# Altium schematic sheet CTR-Lower-Main-Board-Rev-B-Power-3.SchDoc: CTR Controller - Power
size B; Author: TWL; Organization: OLogic, Inc.; DocumentNumber: 112216; Revision: A; SheetNumber: 3; SheetTotal: 4; PageSetup: Record=PageOptions|CenterHorizontal=True|CenterVertical=True|PrintScale=0.71|XCorrection=1.00|YCorrection=1.00|PrintKind=0|BorderSize=5000000|LeftOffset=0|BottomOffset=0|Orientation=2|PaperLength=1000|PaperWidth=1000|Scale=100|PaperSource=15|PrintQuality=600|MediaType=1|DitherType=10|PrintScaleMode=1|PaperKind=Letter|PaperIndex=1
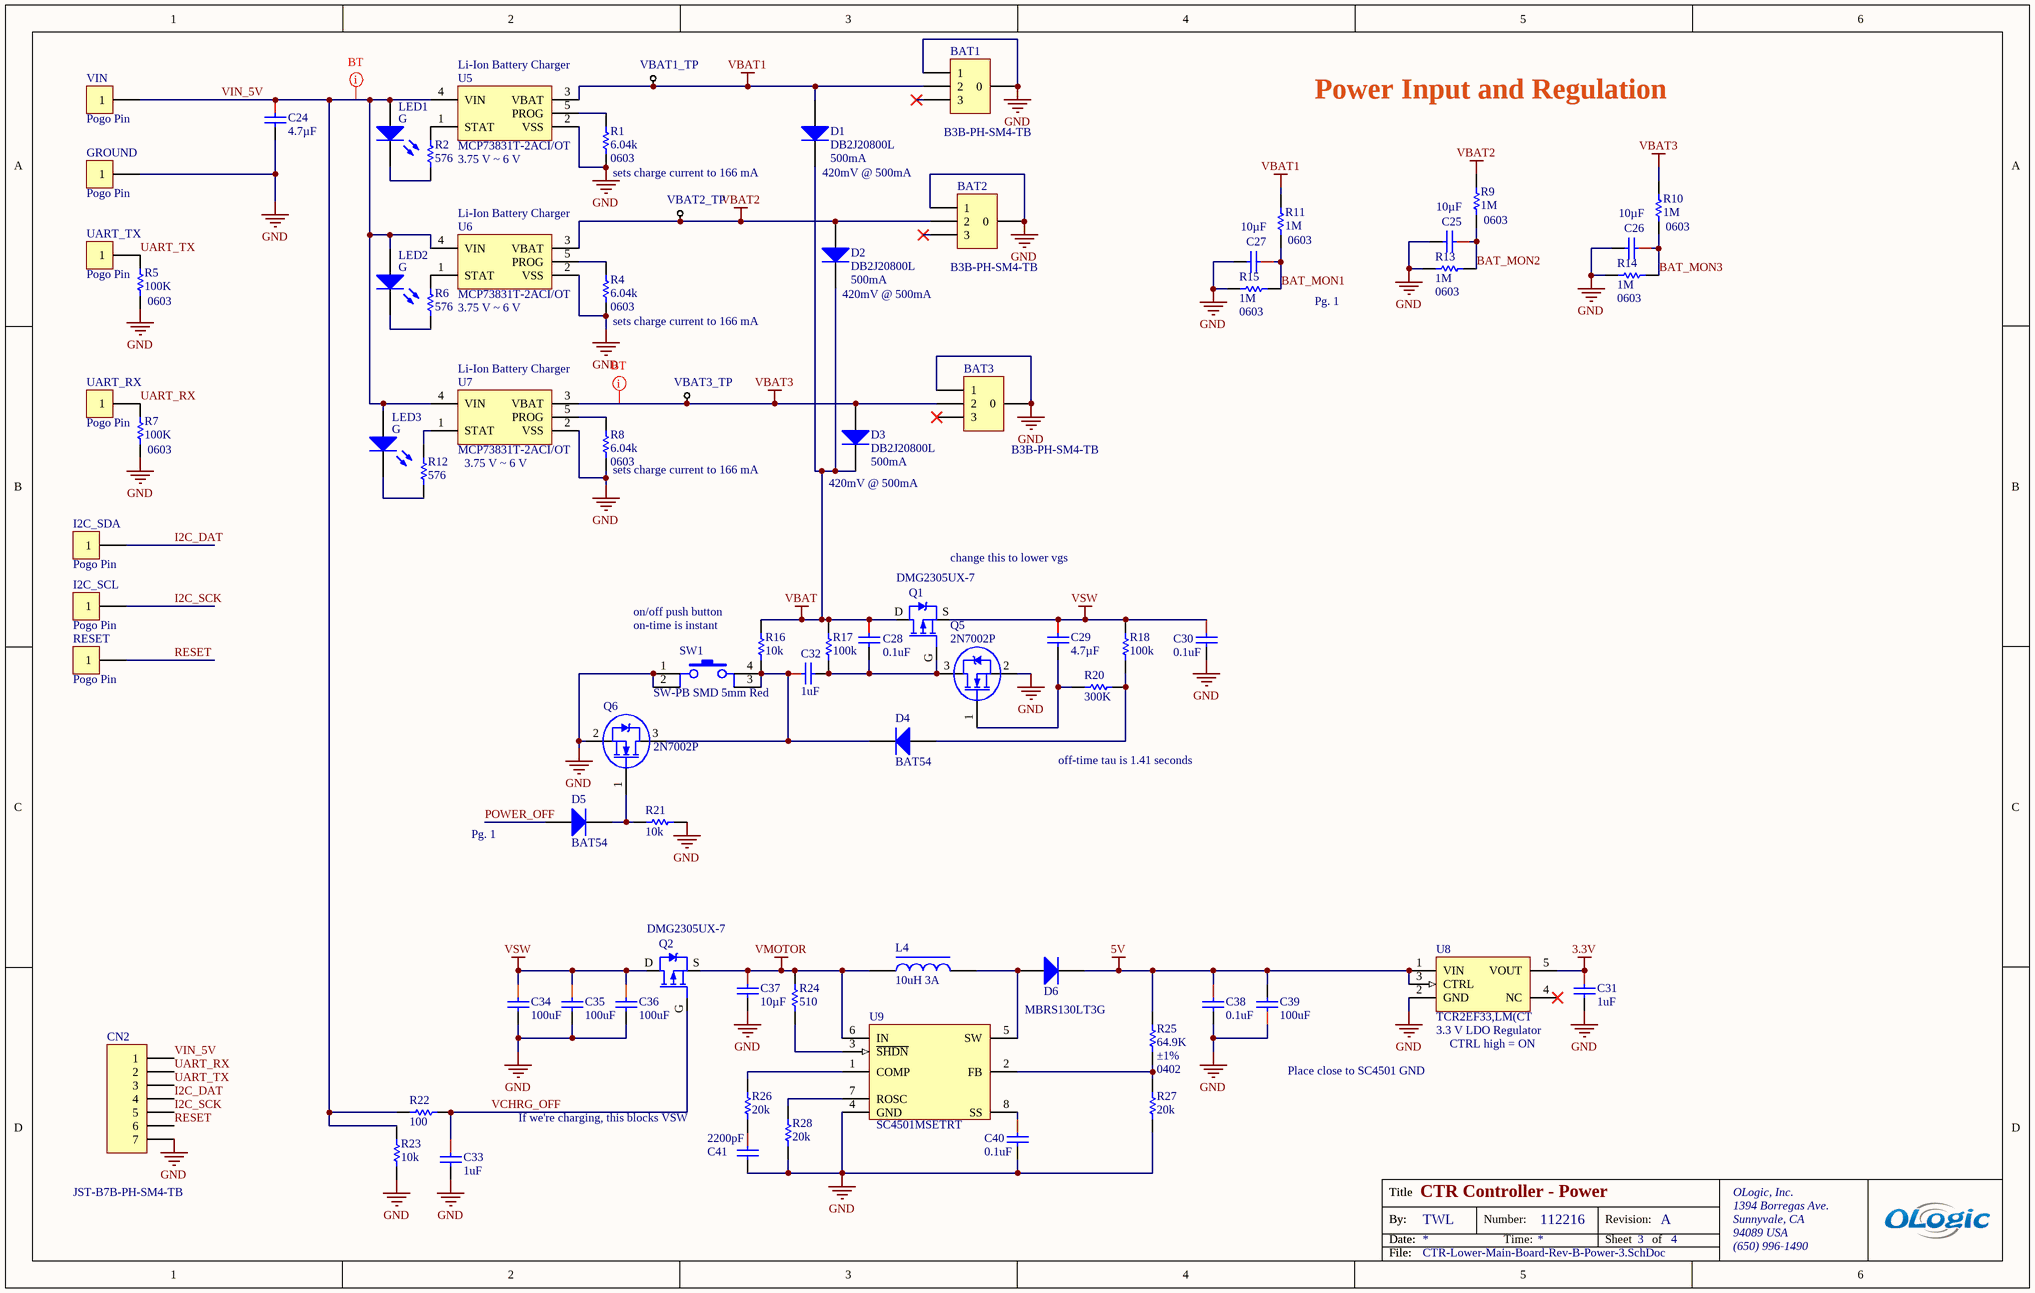
[diagram p0: CTR-Lower-Main-Board-Rev-B-Power-3.SchDoc]

## Parts
BAT1  B3B-PH-SM4-TB  [JST-B3B-PH-SM4-TB]
BAT2  B3B-PH-SM4-TB  [JST-B3B-PH-SM4-TB]
BAT3  B3B-PH-SM4-TB  [JST-B3B-PH-SM4-TB]
C24  Capacitance: 4.7µF  [CAPC0603(1608)_L]  (hidden comment: 4.7UF 0603)
C25  Capacitance: 10µF  [CAPC0603(1608)_N]  (hidden comment: CAP 10UF 10V 10% X5R 0603)
C26  Capacitance: 10µF  [CAPC0603(1608)_N]  (hidden comment: CAP 10UF 10V 10% X5R 0603)
C27  Capacitance: 10µF  [CAPC0603(1608)_N]  (hidden comment: CAP 10UF 10V 10% X5R 0603)
C28  0.1uF  [CAPC0402(1005)_N]
C29  Capacitance: 4.7µF  [CAPC0603(1608)_L]  (hidden comment: 4.7UF 0603)
C30  0.1uF  [CAPC0402(1005)_N]
C31  1uF  [CAPC0402(1005)_N]
C32  1uF  [CAPC0402(1005)_N]
C33  1uF  [CAPC0402(1005)_N]
C34  100uF  [CAPC1210(3225)_N]
C35  100uF  [CAPC1210(3225)_N]
C36  100uF  [CAPC1210(3225)_N]
C37  Capacitance: 10µF  [CAPC0603(1608)_N]  (hidden comment: CAP 10UF 10V 10% X5R 0603)
C38  0.1uF  [CAPC0402(1005)_N]
C39  100uF  [CAPC1210(3225)_N]
C40  0.1uF  [CAPC0402(1005)_N]
C41  2200pF  [CAPC0402(1005)_N]
CN2  JST-B7B-PH-SM4-TB  [JST-B7B-PH-SM4-TB]
D1  Current - Average Rectified (Io): 500mA  Voltage - Forward (Vf) (Max) @ If: 420mV @ 500mA  [SMini2-F5-B]  (hidden comment: DB2J20800L)
D2  Current - Average Rectified (Io): 500mA  Voltage - Forward (Vf) (Max) @ If: 420mV @ 500mA  [SMini2-F5-B]  (hidden comment: DB2J20800L)
D3  Current - Average Rectified (Io): 500mA  Voltage - Forward (Vf) (Max) @ If: 420mV @ 500mA  [SMini2-F5-B]  (hidden comment: DB2J20800L)
D4  BAT54  [SOT23]
D5  BAT54  [SOT23]
D6  Manufacturer Part Number: MBRS130LT3G  [DO-214AA]  (hidden comment: MBRS130LT3)
GROUND  Pogo Pin  [POGO_PIN]
I2C_SCL  Pogo Pin  [POGO_PIN]
I2C_SDA  Pogo Pin  [POGO_PIN]
L4  10uH 3A  [7x7SMINDC]
LED1  G  [SM-LED-0603]
LED2  G  [SM-LED-0603]
LED3  G  [SM-LED-0603]
Q1  DMG2305UX  [DMG2305UX-7]  (value not drawn)
Q2  DMG2305UX  [DMG2305UX-7]  (value not drawn)
Q5  2N7002P  [SOT23]
Q6  2N7002P  [SOT23]
R1  6.04k  Supplier Device Package: 0603  [RESC0603(1608)_N]
R2  576  [RESC0402(1005)_N]
R4  6.04k  Supplier Device Package: 0603  [RESC0603(1608)_N]
R5  100K  Package / Case: 0603  [RESC0603(1608)_N]
R6  576  [RESC0402(1005)_N]
R7  100K  Package / Case: 0603  [RESC0603(1608)_N]
R8  6.04k  Supplier Device Package: 0603  [RESC0603(1608)_N]
R9  1M  Supplier Device Package: 0603  [RESC0603(1608)_N]
R10  1M  Supplier Device Package: 0603  [RESC0603(1608)_N]
R11  1M  Supplier Device Package: 0603  [RESC0603(1608)_N]
R12  576  [RESC0402(1005)_N]
R13  1M  Supplier Device Package: 0603  [RESC0603(1608)_N]
R14  1M  Supplier Device Package: 0603  [RESC0603(1608)_N]
R15  1M  Supplier Device Package: 0603  [RESC0603(1608)_N]
R16  10K  [RESC0402(1005)_N]
R17  Resistance (Ohms): 100k  [RESC0402(1005)_N]  (hidden comment: 100K 0402)
R18  Resistance (Ohms): 100k  [RESC0402(1005)_N]  (hidden comment: 100K 0402)
R20  300K  [RESC0402(1005)_N]
R21  10K  [RESC0402(1005)_N]
R22  Resistance (Ohms): 100  [RESC0402(1005)_N]  (hidden comment: 100 0402)
R23  10K  [RESC0402(1005)_N]
R24  510  [RESC0603(1608)_N]
R25  64.9K  Tolerance: ±1%  Supplier Device Package: 0402  [RESC0402(1005)_N]
R26  Resistance (Ohms): 20k  [RESC0402(1005)_N]  (hidden comment: 20K 0402)
R27  Resistance (Ohms): 20k  [RESC0402(1005)_N]  (hidden comment: 20K 0402)
R28  Resistance (Ohms): 20k  [RESC0402(1005)_N]  (hidden comment: 20K 0402)
RESET  Pogo Pin  [POGO_PIN]
SW1  SW-PB SMD 5mm Red  [SW TACT Red 6mm x 6mm]
U5  Li-Ion Battery Charger  Manufacturer Part Number: MCP73831T-2ACI/OT  Voltage - Supply: 3.75 V ~ 6 V  [SOT23-5]
U6  Li-Ion Battery Charger  Manufacturer Part Number: MCP73831T-2ACI/OT  Voltage - Supply: 3.75 V ~ 6 V  [SOT23-5]
U7  Li-Ion Battery Charger  Manufacturer Part Number: MCP73831T-2ACI/OT  Voltage - Supply: 3.75 V ~ 6 V  [SOT23-5]
U8  3.3 V LDO Regulator  Manufacturer Part Number: TCR2EF33,LM(CT  [TCRFEF]
U9  Manufacturer Part Number: SC4501MSETRT  [SC4501]  (hidden comment: SC4501)
UART_RX  Pogo Pin  [POGO_PIN]
UART_TX  Pogo Pin  [POGO_PIN]
VBAT1_TP  Test Point  [TestPoint-TH 42 mil]  (value not drawn)
VBAT2_TP  Test Point  [TestPoint-TH 42 mil]  (value not drawn)
VBAT3_TP  Test Point  [TestPoint-TH 42 mil]  (value not drawn)
VIN  Pogo Pin  [POGO_PIN]

## Nets
3.3V: C31.1 U8.5(VOUT)
5V: C38.1 C39.2 D6.2(K) R25.2 U8.1(VIN) U8.3(CTRL)
GND: BAT1.0 BAT1.1 BAT2.0 BAT2.1 BAT3.0 BAT3.1 C24.2 C25.2 C26.2 C27.2 C30.2 C31.2 C33.2 C34.2 C35.2 C36.2 C37.2 C38.2 C39.1 C40.2 C41.2 CN2.0 CN2.7 GROUND.1 Q5.2(S) Q6.2(S) R1.1 R4.1 R5.1 R7.1 R8.1 R13.2 R14.2 R15.2 R21.1 R23.1 R27.1 R28.2 SW1.1 SW1.2 U5.2(VSS) U6.2(VSS) U7.2(VSS) U8.2(GND) U9.4(GND)
VBAT: C28.1 D1.1(C) D2.1(C) D3.1(C) Q1.D R16.2 R17.2
VBAT1: BAT1.2 D1.2(A) R11.2 U5.3(VBAT) VBAT1_TP.1
VBAT2: BAT2.2 D2.2(A) R9.2 U6.3(VBAT) VBAT2_TP.1
VBAT3: BAT3.2 D3.2(A) R10.2 U7.3(VBAT) VBAT3_TP.1
VMOTOR: C37.1 L4.1 Q2.S R24.2 U9.6(IN)
VSW: C29.1 C30.1 C34.1 C35.1 C36.1 Q1.S Q2.D R18.2
BAT_MON1: C27.1 R11.1 R15.1
BAT_MON2: C25.1 R9.1 R13.1
BAT_MON3: C26.1 R10.1 R14.1
I2C_DAT: CN2.4 I2C_SDA.1
I2C_SCK: CN2.5 I2C_SCL.1
POWER_OFF: D5.1(A)
RESET: CN2.6 RESET.1
UART_RX: CN2.2 R7.2 UART_RX.1
UART_TX: CN2.3 R5.2 UART_TX.1
VCHRG_OFF: C33.1 Q2.G R22.1
VIN_5V: C24.1 CN2.1 LED1.1 LED2.1 LED3.1 R22.2 R23.2 U5.4(VIN) U6.4(VIN) U7.4(VIN) VIN.1
NetC28_2: C28.2 C32.2 Q1.G Q5.3(D) R17.1
NetC29_2: C29.2 Q5.1(G) R20.2
NetC32_1: C32.1 D4.3(K) Q6.3(D) R16.1 SW1.3 SW1.4
NetC40_1: C40.1 U9.8(SS)
NetC41_1: C41.1 R26.2
NetD4_1: D4.1(A) R18.1 R20.1
NetD5_3: D5.3(K) Q6.1(G) R21.2
NetD6_1: D6.1(A) L4.2 U9.5(SW)
NetLED1_2: LED1.2 R2.2
NetLED2_2: LED2.2 R6.2
NetLED3_2: LED3.2 R12.2
NetR1_2: R1.2 U5.5(PROG)
NetR2_1: R2.1 U5.1(STAT)
NetR4_2: R4.2 U6.5(PROG)
NetR6_1: R6.1 U6.1(STAT)
NetR8_2: R8.2 U7.5(PROG)
NetR12_1: R12.1 U7.1(STAT)
NetR24_1: R24.1 U9.3(~{SHDN})
NetR25_1: R25.1 R27.2 U9.2(FB)
NetR26_1: R26.1 U9.1(COMP)
NetR28_1: R28.1 U9.7(ROSC)

Not connected (* = marked no-connect by the designer): BAT1 3*; BAT2 3*; BAT3 3*; U8 4(NC)*

## Layout directives
net class BT: VBAT3, VIN_5V

## Notes on the sheet
- Power Input and Regulation
- (near R1) sets charge current to 166 mA
- (near R4) sets charge current to 166 mA
- Pg. 1
- (near R8) sets charge current to 166 mA
- change this to lower vgs
- (near R16) on/off push button
- (near R16) on-time is instant
- off-time tau is 1.41 seconds
- CTRL high = ON
- Place close to SC4501 GND
- If we're charging, this blocks VSW
- Title
- By:
- Date:
- Number:
- Time:
- Revision:
- Sheet
- of
- OLogic, Inc.
- 1394 Borregas Ave.
- Sunnyvale, CA
- 94089 USA
- File:
- (650) 996-1490

## Library data of the parts
BAT1-BAT3 = JST-B3B-PH-SM4-TB: 2mm Locking Header, 3-Pin; Manufacturer: JST Sales America Inc; Manufacturer Part Number: B3B-PH-SM4-TB(LF)(SN)(P); Connector Type: Header, Shrouded; Number of Positions: 3; Number of Positions Loaded: All; Pitch: 0.079" (2.00mm); Supplier 1: Digi-Key; RoHS: RoHS Compliant; Category: Connectors, Interconnects; Stock 1: 32550; Pricing 1: 1=0.6, 10=0.566, 25=0.5096, 50=0.4528, 100=0.434, 250=0.39628, 500=0.37742 (USD); Packaging: Cut Tape (CT); Contact Type: Male Pin; Number of Rows: 1; Row Spacing: -; Contact Mating Length: 0.130" (3.30mm); Mounting Type: Surface Mount; Termination: Solder; Fastening Type: Detent Lock; Features: Solder Retention; Contact Finish: Tin; Contact Finish Thickness: -; Color: Natural; ComponentLink1URL: http://www.jst-mfg.com/product/pdf/eng/ePH.pdf; ComponentLink1Description: http://www.jst-mfg.com/product/pdf/eng/ePH.pdf; Supplier Part Number 1: 455-1735-1-ND; test: *
C24 C29 = CAP CER 4.7UF 16V 10% X5R 0603: Manufacturer: Taiyo Yuden; Manufacturer Part Number: EMK107ABJ475KA-T; Tolerance: ±10%; Voltage - Rated: 16V; Temperature Coefficient: X5R; ClassName: power; Supplier 1: Digi-Key; RoHS: RoHS Compliant; Category: Capacitors; Stock 1: 498907; Pricing 1: 1=0.26, 10=0.216, 50=0.1216, 100=0.108, 250=0.081, 500=0.07154, 1000=0.06345 (USD); Packaging: Cut Tape (CT); Mounting Type: Surface Mount, MLCC; Operating Temperature: -55°C ~ 85°C; Applications: General Purpose; Ratings: -; Package / Case: 0603 (1608 Metric); Size / Dimension: 0.063" L x 0.031" W (1.60mm x 0.80mm); Height - Seated (Max): -; Thickness (Max): 0.035" (0.90mm); Lead Spacing: -; Features: -; Lead Style: -; ComponentLink1URL: http://www.yuden.co.jp/or/product/category/capacitor/EMK107ABJ475KA-T.pdf; ComponentLink1Description: http://www.yuden.co.jp/or/product/category/capacitor/EMK107ABJ475KA-T.pdf; Supplier Part Number 1: 587-2786-1-ND; Creator: osman
C25-C27 C37 = CAP 10UF 10V 10% X5R 0603: 10uF 0603; Manufacturer: Samsung Electro-Mechanics America, Inc; Manufacturer Part Number: CL10A106KP8NNNC; Supplier 1: Digi-Key; RoHS: RoHS Compliant; Category: Capacitors; Stock 1: 157585; Pricing 1: 1=0.48, 10=0.42, 25=0.3, 100=0.21, 500=0.153, 1000=0.138 (USD); Packaging: Cut Tape (CT); Tolerance: ±10%; Voltage - Rated: 10V; Temperature Coefficient: X5R; Mounting Type: Surface Mount, MLCC; Operating Temperature: -55°C ~ 85°C; Applications: General Purpose; Ratings: -; Package / Case: 0603 (1608 Metric); Size / Dimension: 0.063" L x 0.031" W (1.60mm x 0.80mm); Height - Seated (Max): -; Thickness (Max): 0.035" (0.90mm); Lead Spacing: -; Features: -; Lead Style: -; ComponentLink1URL: http://www.samsungsem.com/kr/front/downloadcms.do?path=/kr/support/product-search/mlcc/__icsFiles/afieldfile/2014/11/05&fileName=S_CL10A106KP8NNNC.pdf; ComponentLink1Description: http://www.samsungsem.com/kr/front/downloadcms.do?path=/kr/support/product-search/mlcc/__icsFiles/afieldfile/2014/11/05&fileName=S_CL10A106KP8NNNC.pdf; Supplier Part Number 1: 1276-1192-1-ND; Creator: osman
  C25-C27: ClassName: *
  C37: ClassName: 5V
C28 C30 C38 C40 = CAP CER 0.1UF 50V 10% X7R 0402: 0.1uF 0402 50V; Manufacturer: TDK Corporation; Manufacturer Part Number: CGA2B3X7R1H104K050BB; Capacitance: 0.1µF; Tolerance: ±10%; Temperature Coefficient: X7R; Supplier 1: Digi-Key; RoHS: RoHS Compliant; Category: Capacitors; Stock 1: 1584397; Pricing 1: 1=0.16, 10=0.11, 100=0.0523, 250=0.044, 500=0.03686, 1000=0.03025, 5000=0.02558 (USD); Packaging: Cut Tape (CT); Voltage - Rated: 50V; Mounting Type: Surface Mount, MLCC; Operating Temperature: -55°C ~ 125°C; Applications: Automotive; Ratings: AEC-Q200; Package / Case: 0402 (1005 Metric); Size / Dimension: 0.039" L x 0.020" W (1.00mm x 0.50mm); Height - Seated (Max): -; Thickness (Max): 0.022" (0.55mm); Lead Spacing: -; Features: -; Lead Style: -; ComponentLink1URL: http://product.tdk.com/en/catalog/datasheets/mlcc_automotive_general_en.pdf; ComponentLink1Description: http://product.tdk.com/en/catalog/datasheets/mlcc_automotive_general_en.pdf; Supplier Part Number 1: 445-6899-1-ND; Creator: osman
  C28 C30: ClassName: power
  C38 C40: ClassName: 5V
C31-C33 = CAP CER 1UF 16V 10% X5R 0402: 1UF 0402; Manufacturer: TDK Corporation; Manufacturer Part Number: C1005X5R1C105K050BC; Capacitance: 1.0µF; Tolerance: ±10%; Voltage - Rated: 16V; Temperature Coefficient: X5R; ClassName: power; Supplier 1: Digi-Key; RoHS: RoHS Compliant; Category: Capacitors; Stock 1: 490204; Pricing 1: 1=0.12, 10=0.08, 100=0.038, 250=0.032, 500=0.0268, 1000=0.022, 5000=0.0186 (USD); Packaging: Cut Tape (CT); Mounting Type: Surface Mount, MLCC; Operating Temperature: -55°C ~ 85°C; Applications: General Purpose; Ratings: -; Package / Case: 0402 (1005 Metric); Size / Dimension: 0.039" L x 0.020" W (1.00mm x 0.50mm); Height - Seated (Max): -; Thickness (Max): 0.022" (0.55mm); Lead Spacing: -; Features: -; Lead Style: -; ComponentLink1URL: http://product.tdk.com/en/catalog/datasheets/mlcc_commercial_general_en.pdf; ComponentLink1Description: http://product.tdk.com/en/catalog/datasheets/mlcc_commercial_general_en.pdf; Supplier Part Number 1: 445-4978-1-ND
C34-C36 C39 = CAP CER 100UF 16V 20% X5R 1210: 100uF 1210; Manufacturer: Taiyo Yuden; Manufacturer Part Number: EMK325ABJ107MM-T; Capacitance: 100µF; Tolerance: ±20%; Voltage - Rated: 16V; Temperature Coefficient: X5R; ClassName: 5V; Supplier 1: Digi-Key; RoHS: RoHS Compliant; Category: Capacitors; Stock 1: 220900; Pricing 1: 1=2.3, 10=1.882, 50=1.6524, 100=1.3311, 250=1.1016 (USD); Packaging: Cut Tape (CT); Mounting Type: Surface Mount, MLCC; Operating Temperature: -55°C ~ 85°C; Applications: General Purpose; Ratings: -; Package / Case: 1210 (3225 Metric); Size / Dimension: 0.126" L x 0.098" W (3.20mm x 2.50mm); Height - Seated (Max): -; Thickness (Max): 0.106" (2.70mm); Lead Spacing: -; Features: -; Lead Style: -; ComponentLink1URL: http://www.yuden.co.jp/productdata/catalog/en/mlcc_all_e.pdf; ComponentLink1Description: http://www.yuden.co.jp/productdata/catalog/en/mlcc_all_e.pdf; Supplier Part Number 1: 587-3152-1-ND
C41 = CAP CER 2200PF 50V 10% X7R 0402: 2200pF 0402; Manufacturer: Yageo; Manufacturer Part Number: CC0402KRX7R9BB222; Tolerance: ±10%; Voltage - Rated: 50V; Temperature Coefficient: X7R; Supplier 1: Digi-Key; RoHS: RoHS Compliant; Category: Capacitors; Stock 1: 591174; Pricing 1: 1=0.1, 10=0.014, 25=0.0096, 100=0.0062, 250=0.00508, 500=0.00436, 1000=0.00339, 2500=0.00305, 5000=0.00283 (USD); Packaging: Cut Tape (CT); Capacitance: 2200pF; Mounting Type: Surface Mount, MLCC; Operating Temperature: -55°C ~ 125°C; Applications: General Purpose; Ratings: -; Package / Case: 0402 (1005 Metric); Size / Dimension: 0.039" L x 0.020" W (1.00mm x 0.50mm); Height - Seated (Max): -; Thickness (Max): 0.022" (0.55mm); Lead Spacing: -; Features: -; Lead Style: -; ComponentLink1URL: http://www.yageo.com/documents/recent/UPY-GPHC_X7R_6.3V-to-50V-v12.pdf; ComponentLink1Description: http://www.yageo.com/documents/recent/UPY-GPHC_X7R_6.3V-to-50V-v12.pdf; Supplier Part Number 1: 311-1037-1-ND; Creator: osman; ClassName: 5V
CN2 = JST-B7B-PH-SM4-TB: 2mm Locking Header, 7-Pin; Manufacturer: JST Sales America Inc.; Manufacturer Part Number: B7B-PH-SM4-TB(LF)(SN); Connector Type: Header, Shrouded; Number of Positions: 7; Number of Positions Loaded: All; Pitch: 0.079" (2.00mm); Supplier 1: Digi-Key; RoHS: RoHS Compliant; Category: Connectors, Interconnects; Stock 1: 5844; Pricing 1: 1=0.94, 10=0.827, 100=0.7138, 500=0.58404 (USD); Packaging: Cut Tape (CT); Contact Type: Male Pin; Number of Rows: 1; Row Spacing: -; Contact Mating Length: 0.130" (3.30mm); Mounting Type: Surface Mount; Termination: Solder; Fastening Type: Detent Lock; Features: Solder Retention; Contact Finish: Tin; Contact Finish Thickness: -; Color: Natural; ComponentLink1URL: http://www.jst-mfg.com/product/pdf/eng/ePH.pdf; ComponentLink1Description: http://www.jst-mfg.com/product/pdf/eng/ePH.pdf; Supplier Part Number 1: 455-1739-1-ND
D1-D3 = DB2J20800L: DIODE SCHOTTKY 20V 500MA SMINI2; Manufacturer: Panasonic Electronic Components; Speed: Fast Recovery =< 500ns, > 200mA (Io); Reverse Recovery Time (trr): 4.3ns; Current - Reverse Leakage @ Vr: 200µA @ 20V; Capacitance @ Vr, F: 12pF @ 10V, 1MHz; Supplier 1: Digi-Key; RoHS: RoHS Compliant; Category: Discrete Semiconductor Products; Stock 1: 1539; Pricing 1: 1=0.1, 10=0.08, 25=0.0644, 100=0.0501, 250=0.04864, 500=0.0472, 1000=0.0429 (USD); Packaging: Cut Tape (CT); Diode Type: Schottky; Voltage - DC Reverse (Vr) (Max): 20V; Mounting Type: Surface Mount; Package / Case: SC-90, SOD-323F; Supplier Device Package: SMini2-F5-B; Operating Temperature - Junction: 125°C (Max); ComponentLink1URL: http://industrial.panasonic.com/www-cgi/jvcr13pz.cgi?E+SC+4+CDF7002+DB2J208+8+WW; ComponentLink1Description: http://industrial.panasonic.com/www-cgi/jvcr13pz.cgi?E+SC+4+CDF7002+DB2J208+8+WW; Supplier Part Number 1: DB2J20800LCT-ND; Creator: osman; Manufacturer Part Number: DB2J20800L
D4 D5 = BAT54: Schottky Barrier Diode; Manufacturer: Fairchild; Vendor: Digikey; PN: BAT54FSCT-ND; Voltage - DC Reverse (Vr) (Max): 30V; Current - Average Rectified (Io): 200mA; Voltage - Forward (Vf) (Max) @ If: 800mV @ 100mA; Speed: Small Signal =< 200mA (Io), Any Speed; Reverse Recovery Time (trr): 5ns; Current - Reverse Leakage @ Vr: 2µA @ 25V; Capacitance @ Vr, F: 10pF @ 1V, 1MHz; Supplier 1: Digi-Key; Manufacturer Part Number: BAT54; RoHS: RoHS Compliant; Category: Discrete Semiconductor Products; Stock 1: 104473; Pricing 1: 1=0.15, 10=0.142, 25=0.1288, 100=0.0927, 250=0.0546, 500=0.0453, 1000=0.0309 (USD); Packaging: Cut Tape (CT); Diode Type: Schottky; Mounting Type: Surface Mount; Package / Case: TO-236-3, SC-59, SOT-23-3; Supplier Device Package: SOT-23-3 (TO-236); Operating Temperature - Junction: -55°C ~ 150°C; ComponentLink1URL: http://www.fairchildsemi.com/datasheets/BA/BAT54.pdf; ComponentLink1Description: http://www.fairchildsemi.com/datasheets/BA/BAT54.pdf; Supplier Part Number 1: BAT54FSCT-ND; ClassName: power
D6 = MBRS130LT3: Schottky Barrier Rectifier 1A 30V; Manufacturer: ON Semiconductor; Current - Average Rectified (Io): 2A; Voltage - Forward (Vf) (Max) @ If: 445mV @ 2A; Speed: Fast Recovery =< 500ns, > 200mA (Io); Current - Reverse Leakage @ Vr: 1mA @ 30V; Supplier 1: Digi-Key; Supplier Part Number 1: MBRS130LT3GOSCT-ND; RoHS: RoHS Compliant; Category: Discrete Semiconductor Products; Stock 1: 53201; Pricing 1: 1=0.42, 10=0.317, 100=0.1977, 500=0.13526, 1000=0.10404 (USD); Packaging: Cut Tape (CT); Part Status: Active; Diode Type: Schottky; Voltage - DC Reverse (Vr) (Max): 30V; Reverse Recovery Time (trr): -; Capacitance @ Vr, F: -; Mounting Type: Surface Mount; Package / Case: DO-214AA, SMB; Supplier Device Package: SMB; Operating Temperature - Junction: -65°C ~ 125°C; ComponentLink1URL: http://www.onsemi.com/pub_link/Collateral/MBRS130LT3-D.PDF; ComponentLink1Description: http://www.onsemi.com/pub_link/Collateral/MBRS130LT3-D.PDF
GROUND I2C_SCL I2C_SDA RESET UART_RX UART_TX VIN = 0850-0-15-20-83-14-11-0: Manufacturer: Mill-Max Manufacturing Corp.; Plating: Gold; Plating - Thickness: 20µin (0.51µm); Supplier 1: Digi-Key; Manufacturer Part Number: 0850-0-15-20-83-14-11-0; RoHS: RoHS Compliant; Category: Connectors, Interconnects; Stock 1: 38651; Pricing 1: 1=1.89, 10=1.47, 25=1.3708, 50=1.246, 100=1.1214, 250=0.94696, 500=0.89712, 1000=0.79744, 2500=0.66287 (USD); Part Status: Active; Material: Copper Alloy; Mounting Type: Through Hole; ComponentLink1URL: http://www.mill-max.com/assets/pdfs/028.pdf; ComponentLink1Description: http://www.mill-max.com/assets/pdfs/028.pdf; Supplier Part Number 1: ED90436-ND
L4 = INDUCTOR PWR 10UH 3A SMD: 10uH 3A 7.8x7.0mm; Manufacturer: Bourns Inc.; Manufacturer Part Number: SRP7030-100M; Type: Wirewound; Material - Core: Iron; Inductance: 10µH; Tolerance: ±20%; Current - Saturation: 4.5A; Shielding: Shielded; DC Resistance (DCR): 85 mOhm Max; Frequency - Test: 100kHz; Supplier 1: Digi-Key; RoHS: RoHS Compliant; Category: Inductors, Coils, Chokes; Stock 1: 3936; Pricing 1: 1=1.11, 10=1.041, 25=0.9712, 50=0.8326, 100=0.7909, 250=0.72152, 500=0.63826 (USD); Packaging: Cut Tape (CT); Current Rating: 3A; Q @ Freq: -; Frequency - Self Resonant: -; Operating Temperature: -55°C ~ 150°C; Mounting Type: Surface Mount; Package / Case: Non Standard; Size / Dimension: 0.307" L x 0.276" W (7.80mm x 7.00mm); Height - Seated (Max): 0.126" (3.20mm); Supplier Device Package: -; ComponentLink1URL: http://www.bourns.com/data/global/pdfs/SRP7030.pdf; ComponentLink1Description: http://www.bourns.com/data/global/pdfs/SRP7030.pdf; Supplier Part Number 1: SRP7030-100MCT-ND; ClassName: 5V
LED1-LED3 = LED GREEN CLEAR THIN 0603 SMD: 0603 SMD GREEN LED; Manufacturer: Lite-On Inc; Manufacturer Part Number: LTST-C191KGKT; Wavelength - Dominant: 571nm; Wavelength - Peak: 574nm; Millicandela Rating: 35mcd; Voltage - Forward (Vf) (Typ): 2V; Current - Test: 20mA; Viewing Angle: 130°; Lens Type: Clear; Lens Style/Size: Rectangle with Flat Top, 1.1mm x 0.8mm; Supplier 1: Digi-Key; RoHS: RoHS Compliant; Category: Optoelectronics; Stock 1: 84829; Pricing 1: 1=0.3, 10=0.238, 100=0.1296, 250=0.0864, 500=0.07344, 1000=0.05616, 2500=0.05076 (USD); Packaging: Cut Tape (CT); Color: Green; Package / Case: 0603 (1608 Metric); Size / Dimension: 1.60mm L x 0.80mm W; Height: 0.55mm; Mounting Type: Surface Mount; Luminous Flux @ Current - Test: -; ComponentLink1URL: http://optoelectronics.liteon.com/upload/download/DS22-2000-228/S_110_LTST-C191KGKT.pdf; ComponentLink1Description: http://optoelectronics.liteon.com/upload/download/DS22-2000-228/S_110_LTST-C191KGKT.pdf; Supplier Part Number 1: 160-1446-1-ND; ClassName: power
Q1 Q2 = DMG2305UX: MOSFET P-CH 20V 4.2A SOT23; Manufacturer: Diodes Incorporated; FET Type: MOSFET P-Channel, Metal Oxide; FET Feature: Standard; Current - Continuous Drain (Id) @ 25°C: 4.2A (Ta); Rds On (Max) @ Id, Vgs: 52 mOhm @ 4.2A, 4.5V; Vgs(th) (Max) @ Id: 900mV @ 250µA; Gate Charge (Qg) @ Vgs: 10.2nC @ 4.5V; Input Capacitance (Ciss) @ Vds: 808pF @ 15V; Power - Max: 1.4W; Supplier 1: Digi-Key; RoHS: RoHS Compliant; Category: Discrete Semiconductor Products; Stock 1: 78669; Pricing 1: 1=0.38, 10=0.311, 100=0.1649, 500=0.10846, 1000=0.0739 (USD); Packaging: Cut Tape (CT); Drain to Source Voltage (Vdss): 20V; Operating Temperature: -55°C ~ 150°C (TJ); Mounting Type: Surface Mount; Package / Case: TO-236-3, SC-59, SOT-23-3; Supplier Device Package: SOT-23; ComponentLink1URL: http://www.diodes.com/_files/datasheets/DMG2305UX.pdf; ComponentLink1Description: http://www.diodes.com/_files/datasheets/DMG2305UX.pdf; Supplier Part Number 1: DMG2305UX-7DICT-ND; Creator: osman; Manufacturer Part Number: DMG2305UX-7
Q5 Q6 = 2N7002P: MOSFET N-CH 60V 0.36A SOT-23; Manufacturer: NXP Semiconductors; Manufacturer Part Number: 2N7002P,235; FET Type: MOSFET N-Channel, Metal Oxide; FET Feature: Logic Level Gate; Current - Continuous Drain (Id) @ 25°C: 360mA (Ta); Rds On (Max) @ Id, Vgs: 1.6 Ohm @ 500mA, 10V; Vgs(th) (Max) @ Id: 2.4V @ 250µA; Gate Charge (Qg) @ Vgs: 0.8nC @ 4.5V; Input Capacitance (Ciss) @ Vds: 50pF @ 10V; Power - Max: 350mW; Supplier 1: Digi-Key; RoHS: RoHS Compliant; Category: Discrete Semiconductor Products; Stock 1: 4190; Pricing 1: 1=0.15, 10=0.135, 25=0.1224, 100=0.0881, 250=0.05188, 500=0.04304, 1000=0.02936, 2500=0.02498, 5000=0.02252 (USD); Packaging: Cut Tape (CT); Drain to Source Voltage (Vdss): 60V; Mounting Type: Surface Mount; Package / Case: TO-236-3, SC-59, SOT-23-3; Supplier Device Package: SOT-23 (TO-236AB); ComponentLink1URL: http://www.nxp.com/documents/data_sheet/2N7002P.pdf; ComponentLink1Description: http://www.nxp.com/documents/data_sheet/2N7002P.pdf; Supplier Part Number 1: 568-11588-1-ND; ClassName: power
R1 R4 R8 = RES 6.04K OHM 1/8W 1% 0603: 6.04K 0603 RNCP0603FTD6K04; Manufacturer: Stackpole Electronics Inc.; Tolerance: ±1%; Power (Watts): 0.125W, 1/8W; Temperature Coefficient: ±100ppm/°C; Supplier 1: Digi-Key; Manufacturer Part Number: RNCP0603FTD6K04; RoHS: RoHS Compliant; Category: Resistors; Stock 1: 13656; Pricing 1: 1=0.1, 10=0.029, 25=0.0208, 50=0.0158, 100=0.0117, 250=0.00892, 500=0.00712, 1000=0.00525 (USD); Packaging: Cut Tape (CT); Part Status: Active; Resistance (Ohms): 6.04k; Composition: Thin Film; Features: Anti-Sulfur, Moisture Resistant; Operating Temperature: -55°C ~ 155°C; Package / Case: 0603 (1608 Metric); Size / Dimension: 0.059" L x 0.031" W (1.50mm x 0.80mm); Height - Seated (Max): 0.020" (0.50mm); Number of Terminations: 2; Failure Rate: -; ComponentLink1URL: http://www.seielect.com/Catalog/SEI-rncp.pdf; ComponentLink1Description: http://www.seielect.com/Catalog/SEI-rncp.pdf; Supplier Part Number 1: RNCP0603FTD6K04CT-ND
R2 R6 R12 = RES 576 OHM 1% 1/10W 0402: 575 0402; Manufacturer: Panasonic Electronic Components; Manufacturer Part Number: ERJ-2RKF5760X; Tolerance: ±1%; Power (Watts): 0.1W, 1/10W; Temperature Coefficient: ±100ppm/°C; ClassName: power; Supplier 1: Digi-Key; RoHS: RoHS Compliant; Category: Resistors; Stock 1: 89189; Pricing 1: 1=0.1, 50=0.0196, 100=0.0149, 250=0.01104, 500=0.00816, 1000=0.00544, 5000=0.00383 (USD); Packaging: Cut Tape (CT); Composition: Thick Film; Features: Automotive AEC-Q200; Operating Temperature: -55°C ~ 155°C; Package / Case: 0402 (1005 Metric); Supplier Device Package: 0402; Size / Dimension: 0.039" L x 0.020" W (1.00mm x 0.50mm); Height: 0.016" (0.40mm); Number of Terminations: 2; ComponentLink1URL: http://industrial.panasonic.com/www-cgi/jvcr13pz.cgi?E+PZ+3+AOA0002+ERJ2RKF5760X+7+WW; ComponentLink1Description: http://industrial.panasonic.com/www-cgi/jvcr13pz.cgi?E+PZ+3+AOA0002+ERJ2RKF5760X+7+WW; Supplier Part Number 1: P576LCT-ND; Creator: osman; Resistance (Ohms): 576
R5 R7 = RES 100K OHM 5% 1/4W 0603: 100K 0603; Manufacturer: Rohm Semiconductor; Manufacturer Part Number: ESR03EZPJ104; Tolerance: ±5%; Power (Watts): 0.25W, 1/4W; Temperature Coefficient: ±200ppm/°C; Supplier 1: Digi-Key; RoHS: RoHS Compliant; Category: Resistors; Stock 1: 33839; Pricing 1: 1=0.1, 10=0.079, 25=0.0544, 100=0.0303, 250=0.0236, 500=0.01876, 1000=0.01331 (USD); Packaging: Cut Tape (CT); Resistance (Ohms): 100k; Composition: Thick Film; Features: Automotive AEC-Q200, Pulse Withstanding; Operating Temperature: -55°C ~ 155°C; Supplier Device Package: 0603 (1608 Metric); Size / Dimension: 0.063" L x 0.031" W (1.60mm x 0.80mm); Height: 0.022" (0.55mm); Number of Terminations: 2; ComponentLink1URL: http://rohmfs.rohm.com/en/products/databook/datasheet/passive/resistor/chip_resistor/esr.pdf; ComponentLink1Description: http://rohmfs.rohm.com/en/products/databook/datasheet/passive/resistor/chip_resistor/esr.pdf; Supplier Part Number 1: RHM100KDCT-ND
R9-R11 R13-R15 = RES 1M OHM 1/10W 1% 0603 SMD: 1M 0603; Manufacturer: Panasonic Electronic Components; Manufacturer Part Number: ERJ-3EKF1004V; Tolerance: ±1%; Power (Watts): 0.1W, 1/10W; Temperature Coefficient: ±100ppm/°C; Supplier 1: Digi-Key; RoHS: RoHS Compliant; Category: Resistors; Stock 1: 709119; Pricing 1: 1=0.1, 50=0.015, 100=0.0114, 250=0.00844, 500=0.00624, 1000=0.00416, 2500=0.00351 (USD); Packaging: Cut Tape (CT); Resistance (Ohms): 1M; Composition: Thick Film; Features: -; Package / Case: 0603 (1608 Metric); Size / Dimension: 0.063" L x 0.031" W (1.60mm x 0.80mm); Height: 0.022" (0.55mm); Number of Terminations: 2; ComponentLink1URL: http://industrial.panasonic.com/www-cgi/jvcr13pz.cgi?E+PZ+3+AOA0002+ERJ3EKF1004V+7+WW; ComponentLink1Description: http://industrial.panasonic.com/www-cgi/jvcr13pz.cgi?E+PZ+3+AOA0002+ERJ3EKF1004V+7+WW; Supplier Part Number 1: P1.00MHCT-ND
R16 R21 R23 = RES 10K OHM 1% 1/10W 0402: 10K 0402; Manufacturer: Panasonic Electronic Components; Manufacturer Part Number: ERJ-2RKF1002X; Tolerance: ±1%; Power (Watts): 0.1W, 1/10W; Temperature Coefficient: ±100ppm/°C; ClassName: power; Supplier 1: Digi-Key; RoHS: RoHS Compliant; Category: Resistors; Stock 1: 8784573; Pricing 1: 1=0.1, 50=0.0196, 100=0.0149, 250=0.01104, 500=0.00816, 1000=0.00544, 5000=0.00383 (USD); Packaging: Cut Tape (CT); Composition: Thick Film; Features: Automotive AEC-Q200; Operating Temperature: -55°C ~ 155°C; Package / Case: 0402 (1005 Metric); Supplier Device Package: 0402; Size / Dimension: 0.039" L x 0.020" W (1.00mm x 0.50mm); Height: 0.016" (0.40mm); Number of Terminations: 2; ComponentLink1URL: http://industrial.panasonic.com/www-cgi/jvcr13pz.cgi?E+PZ+3+AOA0002+ERJ2RKF1002X+7+WW; ComponentLink1Description: http://industrial.panasonic.com/www-cgi/jvcr13pz.cgi?E+PZ+3+AOA0002+ERJ2RKF1002X+7+WW; Supplier Part Number 1: P10.0KLCT-ND; Creator: osman; Resistance (Ohms): 10k
R17 R18 = RES 100K OHM 1% 1/10W 0402: Manufacturer: Panasonic Electronic Components; Manufacturer Part Number: ERJ-2RKF1003X; Tolerance: ±1%; Power (Watts): 0.1W, 1/10W; Temperature Coefficient: ±100ppm/°C; ClassName: power; Supplier 1: Digi-Key; RoHS: RoHS Compliant; Category: Resistors; Stock 1: 3706939; Pricing 1: 1=0.1, 50=0.0196, 100=0.0149, 250=0.01104, 500=0.00816, 1000=0.00544, 5000=0.00383 (USD); Packaging: Cut Tape (CT); Composition: Thick Film; Features: Automotive AEC-Q200; Operating Temperature: -55°C ~ 155°C; Package / Case: 0402 (1005 Metric); Supplier Device Package: 0402; Size / Dimension: 0.039" L x 0.020" W (1.00mm x 0.50mm); Height: 0.016" (0.40mm); Number of Terminations: 2; ComponentLink1URL: http://industrial.panasonic.com/www-cgi/jvcr13pz.cgi?E+PZ+3+AOA0002+ERJ2RKF1003X+7+WW; ComponentLink1Description: http://industrial.panasonic.com/www-cgi/jvcr13pz.cgi?E+PZ+3+AOA0002+ERJ2RKF1003X+7+WW; Supplier Part Number 1: P100KLCT-ND; Creator: osman
R20 = RES 300K OHM 1% 1/10W 0402: 300K 0402; Manufacturer: Panasonic Electronic Components; Manufacturer Part Number: ERJ-2RKF3003X; Tolerance: ±1%; Power (Watts): 0.1W, 1/10W; Temperature Coefficient: ±100ppm/°C; ClassName: power; Supplier 1: Digi-Key; RoHS: RoHS Compliant; Category: Resistors; Stock 1: 135201; Pricing 1: 1=0.1, 50=0.015, 100=0.011, 250=0.0084, 500=0.00674, 1000=0.00496, 5000=0.00355 (USD); Packaging: Cut Tape (CT); Resistance (Ohms): 300k; Composition: Thick Film; Features: Automotive AEC-Q200; Operating Temperature: -55°C ~ 155°C; Package / Case: 0402 (1005 Metric); Supplier Device Package: 0402; Size / Dimension: 0.039" L x 0.020" W (1.00mm x 0.50mm); Height: 0.016" (0.40mm); Number of Terminations: 2; ComponentLink1URL: http://industrial.panasonic.com/www-cgi/jvcr13pz.cgi?E+PZ+3+AOA0002+ERJ2RKF3003X+7+WW; ComponentLink1Description: http://industrial.panasonic.com/www-cgi/jvcr13pz.cgi?E+PZ+3+AOA0002+ERJ2RKF3003X+7+WW; Supplier Part Number 1: P300KLCT-ND
R22 = RES 100 OHM 1% 1/10W 0402: Manufacturer: Panasonic Electronic Components; Manufacturer Part Number: ERJ-2RKF1000X; Tolerance: ±1%; Power (Watts): 0.1W, 1/10W; Temperature Coefficient: ±100ppm/°C; ClassName: power; Creator: osman; Supplier 1: Digi-Key; RoHS: RoHS Compliant; Category: Resistors; Stock 1: 3222499; Pricing 1: 1=0.1, 50=0.0196, 100=0.0149, 250=0.01104, 500=0.00816, 1000=0.00544, 5000=0.00383 (USD); Packaging: Cut Tape (CT); Composition: Thick Film; Features: Automotive AEC-Q200; Operating Temperature: -55°C ~ 155°C; Package / Case: 0402 (1005 Metric); Supplier Device Package: 0402; Size / Dimension: 0.039" L x 0.020" W (1.00mm x 0.50mm); Height: 0.016" (0.40mm); Number of Terminations: 2; ComponentLink1URL: http://industrial.panasonic.com/www-cgi/jvcr13pz.cgi?E+PZ+3+AOA0002+ERJ2RKF1000X+7+WW; ComponentLink1Description: http://industrial.panasonic.com/www-cgi/jvcr13pz.cgi?E+PZ+3+AOA0002+ERJ2RKF1000X+7+WW; Supplier Part Number 1: P100LCT-ND
R24 = RES 510 OHM 1/10W 1% 0603 SMD: 510 0603; Manufacturer: Panasonic Electronic Components; Manufacturer Part Number: ERJ-3EKF5100V; Tolerance: ±1%; Power (Watts): 0.1W, 1/10W; Temperature Coefficient: ±100ppm/°C; Supplier 1: Digi-Key; RoHS: RoHS Compliant; Category: power; Stock 1: 60158; Pricing 1: 1=0.1, 50=0.015, 100=0.0114, 250=0.00844, 500=0.00624, 1000=0.00416, 2500=0.00351 (USD); Packaging: Cut Tape (CT); Resistance (Ohms): 510; Composition: Thick Film; Features: -; Package / Case: 0603 (1608 Metric); Supplier Device Package: 0603; Size / Dimension: 0.063" L x 0.031" W (1.60mm x 0.80mm); Height: 0.022" (0.55mm); Number of Terminations: 2; ComponentLink1URL: http://industrial.panasonic.com/www-cgi/jvcr13pz.cgi?E+PZ+3+AOA0002+ERJ3EKF5100V+7+WW; ComponentLink1Description: http://industrial.panasonic.com/www-cgi/jvcr13pz.cgi?E+PZ+3+AOA0002+ERJ3EKF5100V+7+WW; Supplier Part Number 1: P510HCT-ND; ClassName: 5V
R25 = RES 64.9K OHM 1% 1/10W 0402: Manufacturer: Panasonic Electronic Components; Manufacturer Part Number: ERJ-2RKF6492X; Power (Watts): 0.1W, 1/10W; Temperature Coefficient: ±100ppm/°C; ClassName: 5V; Supplier 1: Digi-Key; RoHS: RoHS Compliant; Category: Resistors; Stock 1: 195930; Pricing 1: 1=0.1, 50=0.015, 100=0.011, 250=0.0084, 500=0.00674, 1000=0.00496, 5000=0.00355 (USD); Packaging: Cut Tape (CT); Resistance (Ohms): 64.9k; Composition: Thick Film; Features: Automotive AEC-Q200; Operating Temperature: -55°C ~ 155°C; Package / Case: 0402 (1005 Metric); Size / Dimension: 0.039" L x 0.020" W (1.00mm x 0.50mm); Height: 0.016" (0.40mm); Number of Terminations: 2; ComponentLink1URL: http://industrial.panasonic.com/www-cgi/jvcr13pz.cgi?E+PZ+3+AOA0002+ERJ2RKF6492X+7+WW; ComponentLink1Description: http://industrial.panasonic.com/www-cgi/jvcr13pz.cgi?E+PZ+3+AOA0002+ERJ2RKF6492X+7+WW; Supplier Part Number 1: P64.9KLCT-ND
R26-R28 = RES 20K OHM 1% 1/10W 0402: Manufacturer: Panasonic Electronic Components; Manufacturer Part Number: ERJ-2RKF2002X; Tolerance: ±1%; Power (Watts): 0.1W, 1/10W; Temperature Coefficient: ±100ppm/°C; Supplier 1: Digi-Key; RoHS: RoHS Compliant; Category: Resistors; Stock 1: 1265803; Pricing 1: 1=0.1, 50=0.0196, 100=0.0149, 250=0.01104, 500=0.00816, 1000=0.00544, 5000=0.00383 (USD); Packaging: Cut Tape (CT); Composition: Thick Film; Features: Automotive AEC-Q200; Operating Temperature: -55°C ~ 155°C; Package / Case: 0402 (1005 Metric); Supplier Device Package: 0402; Size / Dimension: 0.039" L x 0.020" W (1.00mm x 0.50mm); Height: 0.016" (0.40mm); Number of Terminations: 2; ComponentLink1URL: http://industrial.panasonic.com/www-cgi/jvcr13pz.cgi?E+PZ+3+AOA0002+ERJ2RKF2002X+7+WW; ComponentLink1Description: http://industrial.panasonic.com/www-cgi/jvcr13pz.cgi?E+PZ+3+AOA0002+ERJ2RKF2002X+7+WW; Supplier Part Number 1: P20.0KLCT-ND; ClassName: 5V
SW1 = SW-PB SMD 5mm Red: SWITCH TACTILE SPST-NO 0.05A 12V; Manufacturer: C&K Components; Manufacturer Part Number: PTS645SK50SMTR92 LFS; Switch Function: Off-Mom; Contact Rating @ Voltage: 0.05A @ 12VDC; Actuator Type: Standard; Actuator Height off PCB, from Pins: 5.00mm; Actuator Orientation: Top Actuated; Outline: 6.00mm x 6.00mm; Illumination: Non-Illuminated; Operating Force: 260gf; Actuator Material: Polyamide (PA66), Nylon 6/6; Mechanical Life: 100,000 Cycles; Published: 24-Mar-1999; LatestRevisionDate: 17-Jul-2002; LatestRevisionNote: Re-released for DXP Platform.; PackageReference: SPST-2; Publisher: Altium Limited; PackageDescription: Switch; 2 Leads; Supplier 1: Digi-Key; RoHS: RoHS Compliant; Category: Switches; Stock 1: 24906; Pricing 1: 1=0.28, 10=0.271, 25=0.262, 50=0.2524, 100=0.2384, 250=0.2244, 500=0.21506 (USD); Packaging: Cut Tape (CT); Circuit: SPST-NO; Mounting Type: Surface Mount; Termination Style: Gull Wing; Illumination Voltage (Nominal): -; Illumination Type, Color: -; Ingress Protection: -; Features: -; Switch Travel: -; Operating Temperature: -20°C ~ 60°C; ComponentLink1URL: http://www.ck-components.com/14409/pts645_25apr13.pdf/; ComponentLink1Description: http://www.ck-components.com/14409/pts645_25apr13.pdf/; Supplier Part Number 1: CKN9087CT-ND; ClassName: power
U5-U7 = MCP73831: MPN: MCP73831T; Manufacturer: Microchip; PN: MCP73831T-2ACI/OTCT-ND; Vendor: Digikey; Function: Charge Management; Battery Chemistry: Li-Ion, Li-Pol; ClassName: power; Supplier 1: Digi-Key; Supplier Part Number 1: MCP73831T-2ACI/OTCT-ND; RoHS: RoHS Compliant; Category: Integrated Circuits (ICs); Stock 1: 9735; Pricing 1: 1=0.67, 10=0.56, 25=0.47, 100=0.42 (USD); Packaging: Cut Tape (CT); Operating Temperature: -40°C ~ 85°C; Mounting Type: Surface Mount; Package / Case: SC-74A, SOT-753; Supplier Device Package: SOT-23-5; ComponentLink1URL: http://www.microchip.com/mymicrochip/filehandler.aspx?ddocname=en025112; ComponentLink1Description: http://www.microchip.com/mymicrochip/filehandler.aspx?ddocname=en025112
U8 = TCR2EF33: IC REG LDO 3.3V 0.2A ESV; Manufacturer: Toshiba Semiconductor and Storage; Regulator Topology: Positive Fixed; Current - Output: 200mA; Voltage - Dropout (Typical): 0.15V @ 150mA; Number of Regulators: 1; Voltage - Input: Up to 5.5V; Creator: osman; ClassName: power; Supplier 1: Digi-Key; RoHS: RoHS Compliant; Category: Integrated Circuits (ICs); Stock 1: 5005; Pricing 1: 1=0.39, 10=0.278, 25=0.2164, 100=0.1638, 250=0.1158, 500=0.0927, 1000=0.0711 (USD); Packaging: Cut Tape (CT); Voltage - Output: 3.3V; Current - Limit (Min): -; Operating Temperature: -40°C ~ 85°C; Mounting Type: Surface Mount; Package / Case: SC-74A, SOT-753; Supplier Device Package: SMV; ComponentLink1URL: http://www.semicon.toshiba.co.jp/info/docget.jsp?pid=TCR2EF41&lang=en&type=datasheet; ComponentLink1Description: http://www.semicon.toshiba.co.jp/info/docget.jsp?pid=TCR2EF41&lang=en&type=datasheet; Supplier Part Number 1: TCR2EF33LM(CTCT-ND
U9 = SC4501: 2A Switching Step-Up Regulator; Manufacturer: Semtech Corporation; Output Configuration: Positive; Topology: Boost; Output Type: Adjustable; Number of Outputs: 1; Voltage - Input (Min): 1.4V; Voltage - Input (Max): 16V; Voltage - Output (Max): 32V; Current - Output: 2A (Switch); Frequency - Switching: 1.5MHz; Synchronous Rectifier: No; Supplier 1: Digi-Key; Supplier Part Number 1: SC4501MSECT-ND; RoHS: RoHS Compliant; Category: Integrated Circuits (ICs); Stock 1: 10837; Pricing 1: 1=1.73, 10=1.53, 25=1.382, 100=1.2091, 250=1.06104, 500=0.93766, 1000=0.74025 (USD); Packaging: Cut Tape (CT); Part Status: Active; Function: Step-Up; Voltage - Output (Min/Fixed): 1.4V; Operating Temperature: -40°C ~ 85°C (TA); Mounting Type: Surface Mount; Package / Case: 8-TSSOP, 8-MSOP (0.118", 3.00mm Width) Exposed Pad; Supplier Device Package: 8-MSOP-EP; ComponentLink1URL: http://www.semtech.com/images/datasheet/sc4501.pdf; ComponentLink1Description: http://www.semtech.com/images/datasheet/sc4501.pdf
VBAT1_TP VBAT2_TP VBAT3_TP = TestPoint, small: ClassName: IMU